# Altium schematic sheet 04-AD9546_Outputs.SchDoc
size A; SheetNumber: 7; SheetTotal: 16
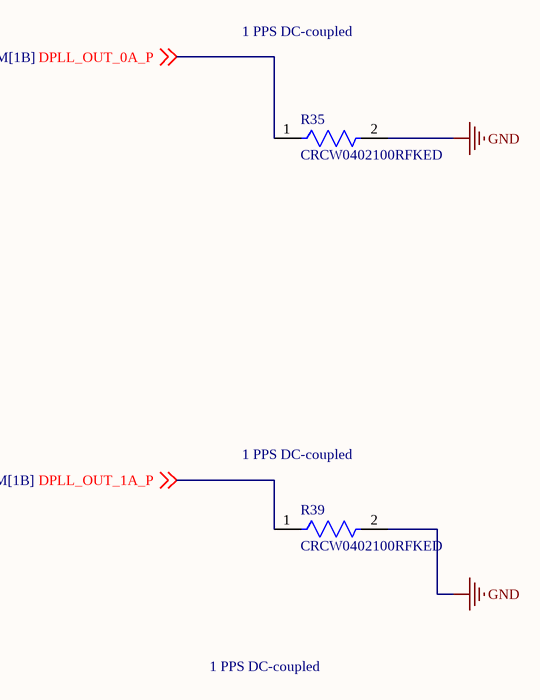
[diagram p0: 04-AD9546_Outputs.SchDoc]

## Parts
R35  CRCW0402100RFKED  [FP-CRCW0402-e3-IPC_C]
R39  CRCW0402100RFKED  [FP-CRCW0402-e3-IPC_C]

## Nets
GND: R35.2 R39.2
DPLL_OUT_0A_P: R35.1 ; off-sheet DPLL_OUT_0A_P
DPLL_OUT_1A_P: R39.1 ; off-sheet DPLL_OUT_1A_P

## Notes on the sheet
- 1 PPS DC-coupled

## Library data of the parts
R35 R39 = CMP-1011-00397-3: RES Thick Film, 100Ω, 1%, 0.063W, 100ppm/°C, 0402; Max Power Dissipation: 63mW; Voltage Rating: 50V; Resistance: 100R; Package Quantity: 10; Lead Free: Lead Free; Termination: SMD/SMT; Case Code (Metric): 1005; Number of Terminations: 2; Composition: Thick Film; Voltage Rating (DC): 50V; Min Operating Temperature: -55°C; Case/Package: 0402; Radiation Hardening: No; Max Operating Temperature: 155°C; Temperature Coefficient: 100ppm/°C; Military Standard: Not; Length: 1mm; Mount: Surface Mount; Power Rating: 63mW; Weight: 2.3E-05oz; Working Voltage: 50V; Features: Automotive AEC-Q200; Depth: 0.5mm; Packaging: Tape and Reel; Tolerance: 1%; Height: 0.35mm; Case Code (Imperial): 0402; Width: 0.02inch; Contact Plating: Tin